# EAGLE design Serial-Enabled-LCD-Kit-v11 (EAGLE 6.2)
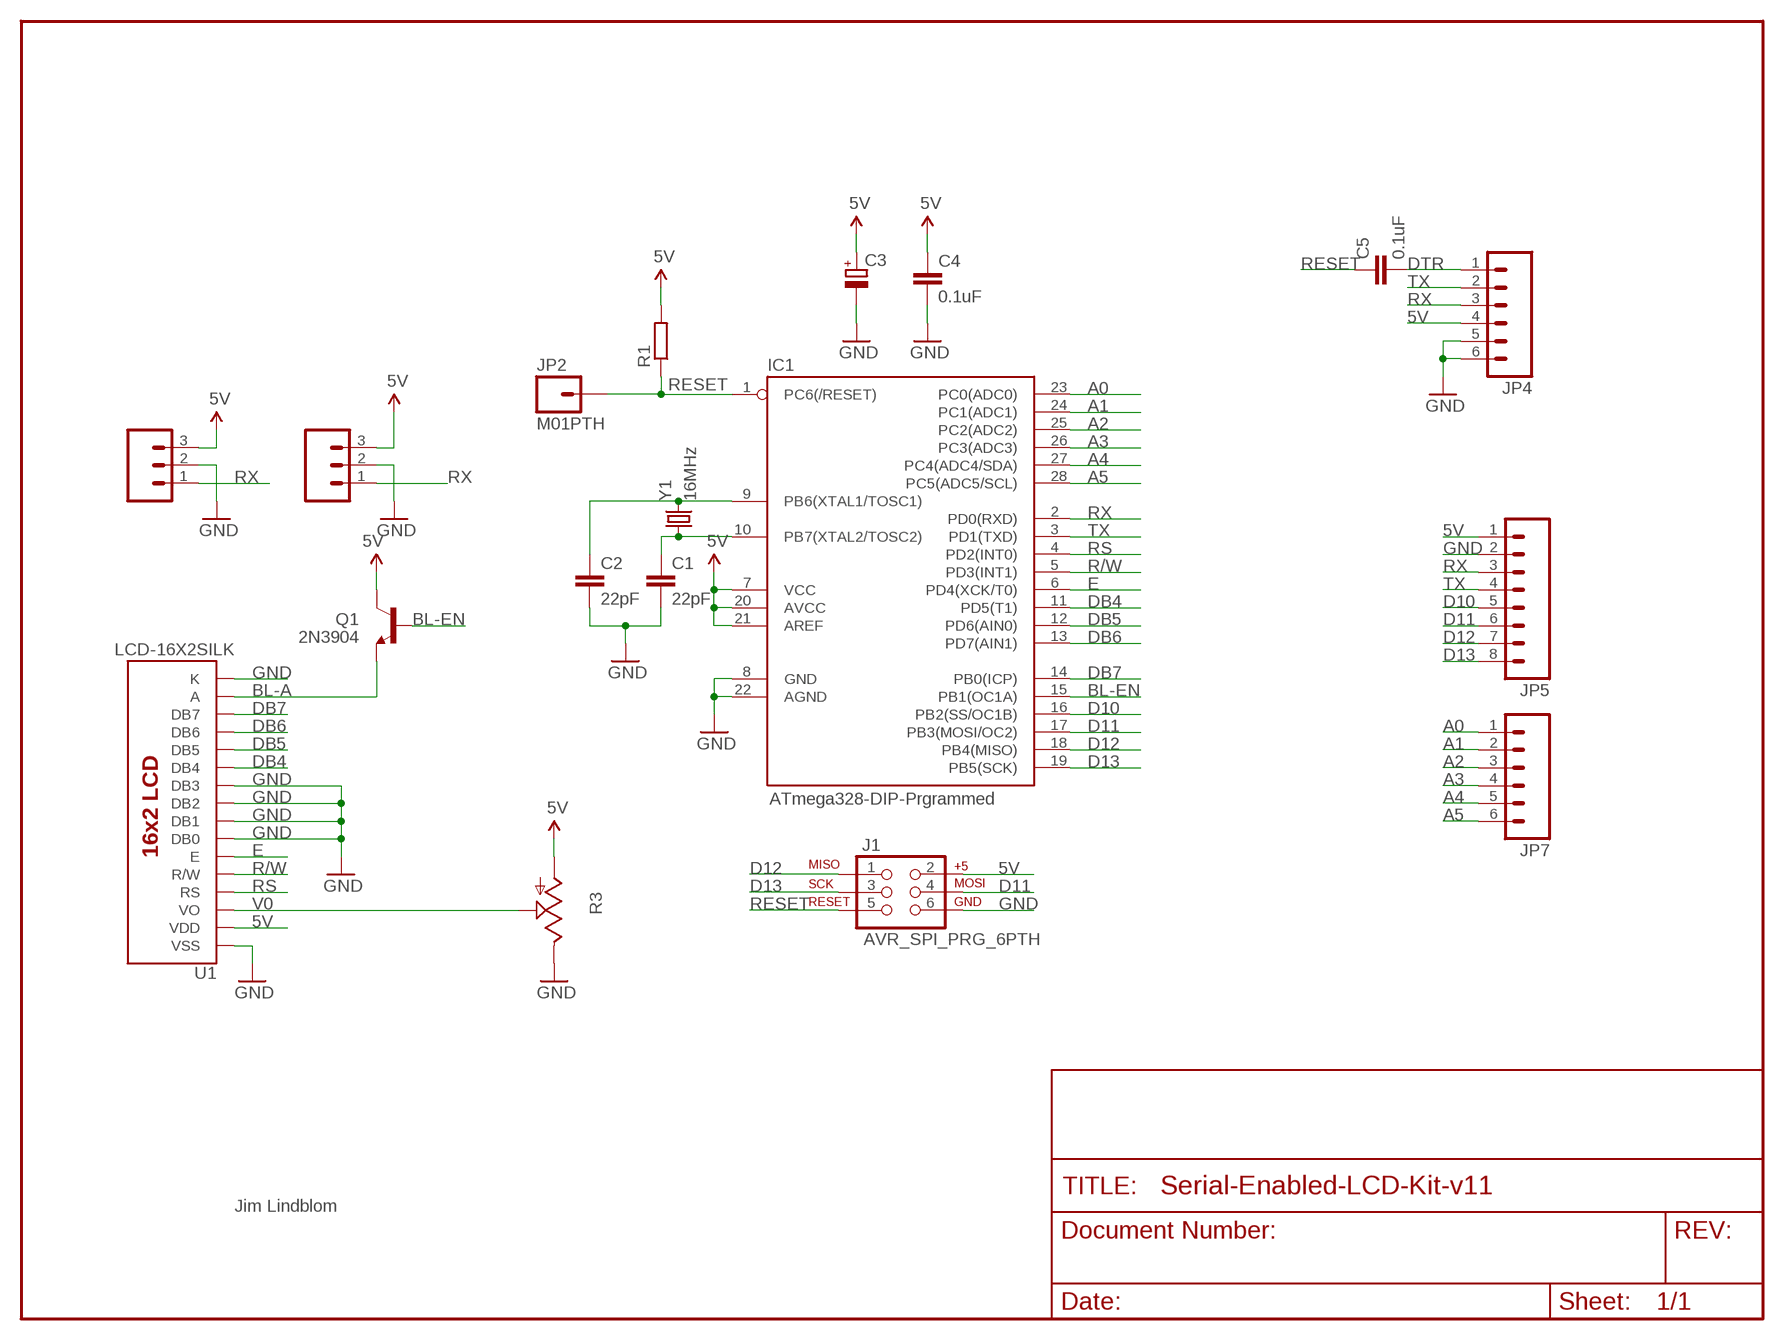
[diagram p0: schematic, sheet 1]

## Parts
C1  22pF  CAPPTH2  [CAP-PTH-SMALL2]
C2  22pF  CAPPTH2  [CAP-PTH-SMALL2]
C3  CPOL-EUE2-4  [E2-4]
C4  0.1uF  CAPPTH2  [CAP-PTH-SMALL2]
C5  0.1uF  CAPPTH2  [CAP-PTH-SMALL2]
IC1  ATmega328-DIP-Prgrammed  AVR-MEGA8-PPTH  [DIL28-3]
J1  AVR_SPI_PRG_6PTH  [2X3]
JP1  M03PTH  [1X03]
JP2  M01PTH  [1X01]
JP4  M06SIP  [1X06]
JP5  M08  [1X08]
JP6  M03PTH  [1X03]
JP7  M06SIP  [1X06]
Q1  2N3904  TRANSISTOR_NPNTO92  [TO-92]
R1  R-EU_0207/10  [0207/10]
R3  TRIM_US-S64W  [S64W]
U1  LCD-16X2SILK  [LCD-16X2]
Y1  16MHz  CRYSTALHC49US  [HC49US]

## Nets
5V: C3.+ C4.1 IC1.7(VCC) IC1.20(AVCC) IC1.21(AREF) J1.2 JP1.3 JP4.4 JP5.1 JP6.3 Q1.3(C) R1.2 R3.A U1.2(VDD)
A0: IC1.23(PC0(ADC0)) JP7.1
A1: IC1.24(PC1(ADC1)) JP7.2
A2: IC1.25(PC2(ADC2)) JP7.3
A3: IC1.26(PC3(ADC3)) JP7.4
A4: IC1.27(PC4(ADC4/SDA)) JP7.5
A5: IC1.28(PC5(ADC5/SCL)) JP7.6
BL-A: Q1.1(E) U1.15(A)
BL-EN: IC1.15(PB1(OC1A)) Q1.2(B)
D10: IC1.16(PB2(SS/OC1B)) JP5.5
D11: IC1.17(PB3(MOSI/OC2)) J1.4 JP5.6
D12: IC1.18(PB4(MISO)) J1.1 JP5.7
D13: IC1.19(PB5(SCK)) J1.3 JP5.8
DB4: IC1.11(PD5(T1)) U1.11(DB4)
DB5: IC1.12(PD6(AIN0)) U1.12(DB5)
DB6: IC1.13(PD7(AIN1)) U1.13(DB6)
DB7: IC1.14(PB0(ICP)) U1.14(DB7)
DTR: C5.2 JP4.1
E: IC1.6(PD4(XCK/T0)) U1.6(E)
GND: C1.2 C2.2 C3.- C4.2 IC1.8(GND) IC1.22(AGND) J1.6 JP1.2 JP4.5 JP4.6 JP5.2 JP6.2 R3.E U1.1(VSS) U1.7(DB0) U1.8(DB1) U1.9(DB2) U1.10(DB3) U1.16(K)
R/W: IC1.5(PD3(INT1)) U1.5(R/W)
RESET: C5.1 IC1.1(PC6(/RESET)) J1.5 JP2.1 R1.1
RS: IC1.4(PD2(INT0)) U1.4(RS)
RX: IC1.2(PD0(RXD)) JP4.3 JP5.3 JP6.1
TX: IC1.3(PD1(TXD)) JP4.2 JP5.4
V0: R3.S U1.3(VO)
XTAL1: C2.1 IC1.9(PB6(XTAL1/TOSC1)) Y1.2
XTAL2: C1.1 IC1.10(PB7(XTAL2/TOSC2)) Y1.1
Unconnected: JP1.1

## Notes on the sheet
- Jim Lindblom

## Library data of the parts
C1 C2 C4 C5 = SparkFun:CAP: Capacitor Standard 0603 ceramic capacitor, and 0.1" leaded capacitor.
C3 = resistor:CPOL-EU: POLARIZED CAPACITOR, European symbol
IC1 = SparkFun:AVR-MEGA8-P: MICROCONTROLLER 8 Kbytes FLASH 1 kbytes SRAM 512 bytes EEPROM USART 4-channel 10 bit ADC 2-channel 8 bit ADC
J1 = SparkFun:AVR_SPI_PRG_6: AVR ISP 6 Pin This is the reduced ISP connector for AVR programming. Common on Arduino. This footprint will take up less PCB space and can be used with a 10-pin to 6-pin adapter such as SKU: BOB-08508
JP1 JP6 = SparkFun:M03: Header 3 Standard 3-pin 0.1" header. Use with straight break away headers (SKU : PRT-00116), right angle break away headers (PRT-00553), swiss pins (PRT-00743), machine pins (PRT-00117), and female headers (PRT-00115). Molex polarized connector foot print use with SKU : PRT-08232 with associated crimp pins and housings.
JP2 = SparkFun:M01: Header 1 Standard 1-pin 0.1" header. Use with straight break away headers (SKU : PRT-00116), right angle break away headers (PRT-00553), swiss pins (PRT-00743), machine pins (PRT-00117), and female headers (PRT-00115).
JP4 JP7 = SparkFun:M06: Header 6 Standard 6-pin 0.1" header. Use with straight break away headers (SKU : PRT-00116), right angle break away headers (PRT-00553), swiss pins (PRT-00743), machine pins (PRT-00117), and female headers (PRT-00115). Molex polarized connector foot print use with SKU : PRT-08094 with associated crimp pins and housings. NOTES ON THE VARIANTS LOCK and LOCK_LONGPADS... This footprint was designed to help hold the alignment of a through-hole component (i.e. 6-pin header) while soldering it into place. You may notice that each hole has been shifted either up or down by 0.005 of an inch from it's more standard position (which is a perfectly straight line). This slight alteration caused the pins (the squares in the middle) to touch the edges of the holes. Because they are alternating, it causes a "brace" to hold the component in place. 0.005 has proven to be the perfect amount of "off-center" position when using our standard breakaway headers. Although looks a little odd when you look at the bare footprint, once you have a header in there, the alteration is very hard to notice. Also, if you push a header all the way into place, it is covered up entirely on the bottom side. This idea of altering the position of holes to aid alignment will be further integrated into the Sparkfun Library for other footprints. It can help hold any component with 3 or more connection pins.
JP5 = SparkFun:M08: Header 8 Standard 8-pin 0.1" header. Use with straight break away headers (SKU : PRT-00116), right angle break away headers (PRT-00553), swiss pins (PRT-00743), machine pins (PRT-00117), and female headers (PRT-00115).
Q1 = SparkFun:TRANSISTOR_NPN: Transistor NPN BJT configuration in SOT23 package. MMBT2222 is the common NPN we use. Double check BCE configuration again layout.
R1 = resistor:R-EU_: RESISTOR, European symbol
R3 = pot:TRIM_US-: POTENTIOMETER
U1 = SparkFun:LCD-16X2
Y1 = SparkFun:CRYSTAL: Crystals Various standard crystals. Proven footprints. Spark Fun Electronics SKU : COM-00534

## Board
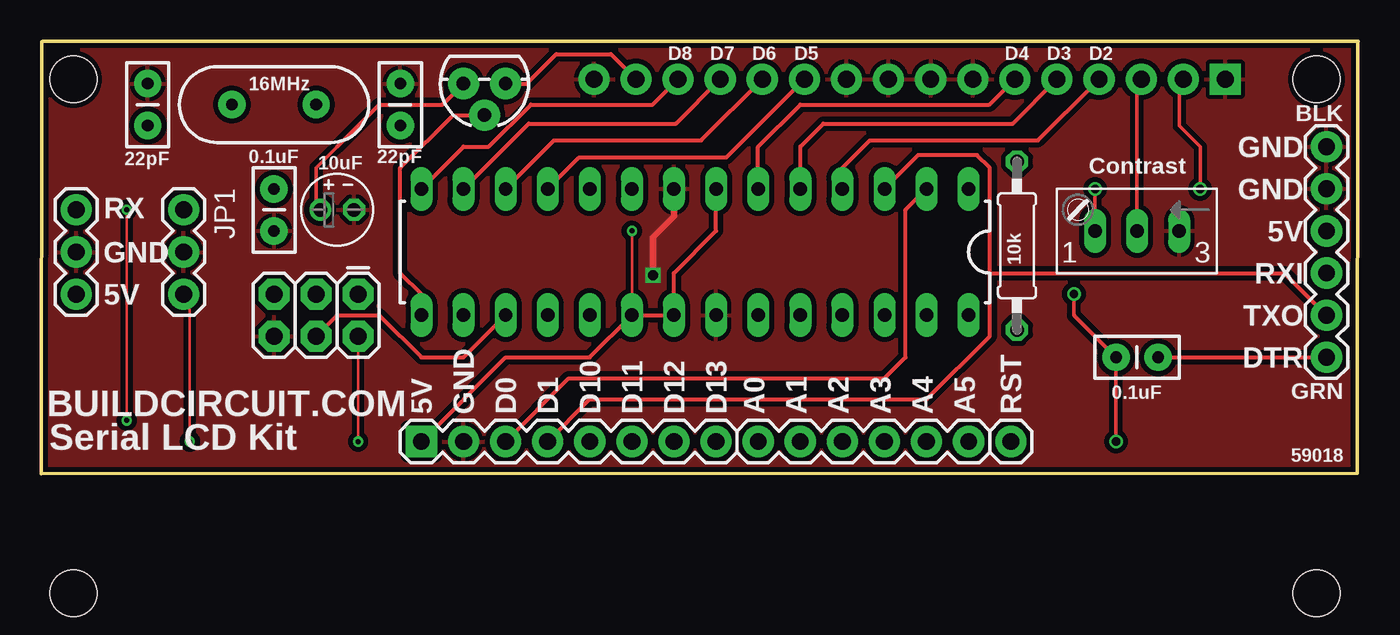
[diagram p1: board, top side]
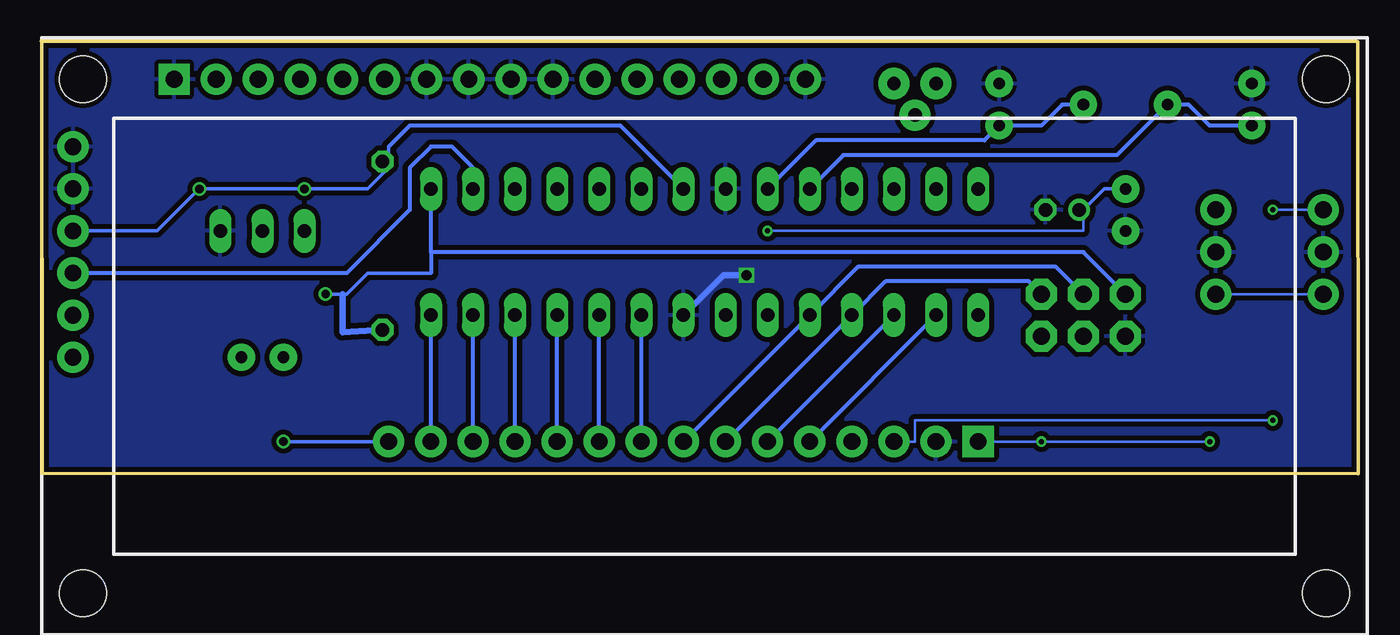
[diagram p2: board, bottom side, seen from below]

Size 79.44 x 26.06 mm. Coordinates in mm from the lower left corner, seen from the top.
Outline: 79.43,25.97 79.39,0.03 0,0 0.01,26.04
Outline: 0.06,26.06 79.44,26.06
Copper layers (1*16): Top 0.035mm / dielectric 1.5mm / Bottom 0.035mm
Design rules: minimum track width 6mil, minimum drill 12mil, track to track 6mil, track to pad 6mil, pad to pad 6mil, via to via 6mil, smd to smd 0mil, copper to edge 10mil, drill to drill 10mil, minimum pad ring 10mil, minimum via ring 6mil, stop-mask expansion 2mil, vias tented up to drill 100mil, thermal gap 10mil

### Footprints (pad centres in the part's own frame; a part is rotated, then mirrored left to right if it is on the bottom)
CAP-PTH-SMALL2 = drill 0.7 pad 1.651: 1 0,0; 2 2.54,0
E2-4 = drill 0.813 pad 1.27: + -1.016,0 | drill 0.813 pad 1.27 octagon: - 1.016,0
DIL28-3 = drill 0.813 long: 1 -16.51,-3.81; 2 -13.97,-3.81; 3 -11.43,-3.81; 4 -8.89,-3.81; 5 -6.35,-3.81; 6 -3.81,-3.81; 7 -1.27,-3.81; 8 1.27,-3.81; 9 3.81,-3.81; 10 6.35,-3.81; 11 8.89,-3.81; 12 11.43,-3.81; 13 13.97,-3.81; 14 16.51,-3.81; 15 16.51,3.81; 16 13.97,3.81; 17 11.43,3.81; 18 8.89,3.81; 19 6.35,3.81; 20 3.81,3.81; 21 1.27,3.81; 22 -1.27,3.81; 23 -3.81,3.81; 24 -6.35,3.81; 25 -8.89,3.81; 26 -11.43,3.81; 27 -13.97,3.81; 28 -16.51,3.81
2X3 = drill 1.016 pad 1.88 octagon: 1 0,0; 2 0,2.54; 3 2.54,0; 4 2.54,2.54; 5 5.08,0; 6 5.08,2.54
1X03 = drill 1.016 pad 1.88: 1 0,0; 2 2.54,0; 3 5.08,0
1X01 = drill 1.016 pad 1.88: 1 0,0
1X06 = drill 1.016 pad 1.88: 1 0,0; 2 2.54,0; 3 5.08,0; 4 7.62,0; 5 10.16,0; 6 12.7,0
1X08 = drill 1.016 pad 1.88 square: 1 0,0 | drill 1.016 pad 1.88: 2 2.54,0; 3 5.08,0; 4 7.62,0; 5 10.16,0; 6 12.7,0; 7 15.24,0; 8 17.78,0
TO-92 = drill 0.813 pad 1.88: 1 -1.27,0; 2 0,1.905; 3 1.27,0
0207/10 = drill 0.813 octagon: 1 -5.08,0; 2 5.08,0
S64W = drill 0.813 long: A 2.54,1.27; E -2.54,1.27; S 0,1.27
LCD-16X2 = drill 1.016 pad 1.88 square: 1 -32,15.5 | drill 1.016 pad 1.88: 2 -29.46,15.5; 3 -26.92,15.5; 4 -24.38,15.5; 5 -21.84,15.5; 6 -19.3,15.5; 7 -16.76,15.5; 8 -14.22,15.5; 9 -11.68,15.5; 10 -9.14,15.5; 11 -6.6,15.5; 12 -4.06,15.5; 13 -1.52,15.5; 14 1.02,15.5; 15 3.56,15.5; 16 6.1,15.5 | hole 2.8: -37.5,15.5; -37.5,-15.5; 37.5,15.5; 37.5,-15.5
HC49US = drill 0.7 pad 1.651: 1 -2.54,0; 2 2.54,0

### Placement (x,y rotation side)
C1  6.41,20.98 90 top
C2  21.65,20.98 90 top
C3  17.84,15.9 0 top
C4  14.03,17.17 270 top
C5  64.83,7.01 0 top
IC1  39.43,13.36 180 top
J1  19.11,10.82 180 top
JP1  8.57,15.9 270 top
JP2  58.48,1.93 0 top
JP4  77.53,7.01 90 top
JP5  22.92,1.93 0 top
JP6  2.1,15.9 270 top
JP7  43.24,1.93 0 top
Q1  26.73,23.52 180 top
R1  58.86,13.74 90 top
R3  66.1,15.9 180 top
U1  39.43,8.28 0 bottom
Y1  14.03,22.25 0 top

### Tracks (layer width: path | path; a pad name or v marks a point on that pad's centre or on a via)
5V  (via drill 0.3, 0.51)
  Top 0.152: v19.11,1.93 J1.2 | v8.95,1.93 8.95,10.82 JP1.3 | IC1.20 v35.62,14.63
  Top 0.203: v69.91,17.17 69.91,19.71 68.64,20.98 68.64,23.52 U1.2 | v63.56,17.17 R3.A | 17.84,19.71 16.57,18.44 16.57,15.9 C3.+
  Top 0.254: Q1.3 24.19,22.25 20.38,22.25 17.84,19.71 | JP5.1 28,7.01 33.08,7.01 IC1.20 IC1.21 38.16,12.09 40.7,14.63 IC1.7 | 77.52,14.62 JP4.4
  Bottom 0.152: JP5.1 v19.11,1.93 v8.95,1.93 | JP6.3 JP1.3 | 16.57,15.9 16.57,14.63 v35.62,14.63
  Bottom 0.203: JP4.4 72.45,14.63 v69.91,17.17 v63.56,17.17 59.75,17.17 58.48,18.44 58.48,18.69 58.48,19.71 | C4.1 15.3,17.17 16.57,15.9 C3.+
  Bottom 0.254: IC1.7 44.51,20.98 57.21,20.98 58.48,19.71
  Bottom 0.406: R1.2 58.48,18.69
A0
  Bottom 0.254: JP7.1 IC1.23
A1
  Bottom 0.254: JP7.2 IC1.24
A2
  Bottom 0.254: JP7.3 IC1.25
A3
  Bottom 0.254: JP7.4 IC1.26
A4
  Bottom 0.254: JP7.5 IC1.27
A5
  Bottom 0.254: JP7.6 IC1.28
BL-A
  Top 0.254: Q1.1 29.27,23.52 31.05,25.3 34.36,25.3 U1.15
BL-EN
  Top 0.254: Q1.2 24.83,21.62 21.65,18.44 21.65,12.09 22.92,10.82 IC1.15
D10
  Bottom 0.254: JP5.5 IC1.16
D11
  Top 0.254: J1.4 17.84,9.55 20.38,9.55 22.92,7.01 25.46,7.01 IC1.17
  Bottom 0.254: IC1.17 JP5.6
D12
  Bottom 0.254: JP5.7 IC1.18 28.51,11.58 19.88,11.58 J1.1
D13
  Bottom 0.254: JP5.8 IC1.19 30.16,12.47 18.22,12.47 J1.3
DB4
  Top 0.254: U1.11 41.33,19.08 32.45,19.08 IC1.11
DB5
  Top 0.254: U1.12 39.8,20.09 30.92,20.09 IC1.12
DB6
  Top 0.254: U1.13 38.28,21.11 29.4,21.11 IC1.13
DB7
  Top 0.254: IC1.14 25.46,19.71 26.99,19.71 29.53,22.25 36.88,22.25 U1.14
DTR
  Top 0.254: C5.2 JP4.1
E
  Top 0.254: U1.6 57.2,22.25 45.78,22.25 43.24,19.71 IC1.6
GND  (via drill 0.6)
  Top 0.406: IC1.8 38.16,15.52 36.89,14.25 v36.89,11.96
  Bottom 0.406: v36.89,11.96 38.29,11.96 IC1.22
  pour Bottom (isolate 0.305): -0.12,25.93 0.04,0.06 79.4,0.14 79.36,25.88
  pour Top (isolate 0.305): -0.06,25.94 -0.05,0.05 79.4,0.14 79.33,25.88
R/W
  Top 0.254: IC1.5 45.78,19.71 47.18,21.11 58.6,21.11 U1.5
RESET  (via drill 0.51)
  Top 0.203: v64.83,1.93 C5.1 | v62.29,10.82 62.29,9.55
  Top 0.254: 62.29,9.55 C5.1
  Bottom 0.203: JP2.1 v64.83,1.93 | v62.29,10.82 61.28,10.82 61.02,10.82 59.75,12.09 55.94,12.09
  Bottom 0.254: J1.5 16.57,13.36 55.94,13.36 | 55.94,13.36 55.94,12.09 | 55.94,13.36 IC1.1
  Bottom 0.406: R1.1 61.28,8.53 61.28,10.82
RS
  Top 0.254: IC1.4 48.32,18.44 49.97,20.09 60.13,20.09 63.56,23.52 63.56,23.53 U1.4
RX  (via drill 0.3)
  Top 0.152: v5.14,3.2 v5.14,15.9
  Top 0.254: IC1.2 52.13,15.9 52.13,7.01 50.86,5.74 31.81,5.74 JP5.3
  Bottom 0.152: v5.14,15.9 JP6.1 | v5.14,3.2 26.73,3.2 26.73,1.93 JP5.3
  Bottom 0.254: IC1.2 53.4,18.44 54.67,19.71 55.94,19.71 57.21,18.44 57.21,15.9 61.02,12.09 JP4.3
TX
  Top 0.254: JP5.4 33.08,4.47 53.4,4.47 57.21,8.28 57.21,12.09 | 57.21,12.09 57.21,18.44 56.45,19.2 52.9,19.2 IC1.3 | JP4.2 74.99,12.09 57.21,12.09
V0
  Top 0.203: U1.3 66.1,23.52 R3.S
XTAL1
  Bottom 0.254: Y1.2 17.84,22.25 19.11,20.98 C2.1 22.54,20.09 32.7,20.09 IC1.9
XTAL2
  Bottom 0.254: C1.1 8.95,20.98 10.22,22.25 Y1.1 14.54,19.2 31.05,19.2 IC1.10

### Text on the board
tPlace: D8 | D7 | D6 | D5 | D4 | D3 | D2 | 16MHz | BLK | GND | 22pF | 0.1uF | 10uF | 22pF | Contrast | GND | RX | 5V | GND | 10k | RXI | 5V | TXO | DTR | GRN | 0.1uF | BUILDCIRCUIT.COM | 5V | GND | D0 | D1 | D10 | D11 | D12 | D13 | A0 | A1 | A2 | A3 | A4 | A5 | RST | Serial LCD Kit | 59018